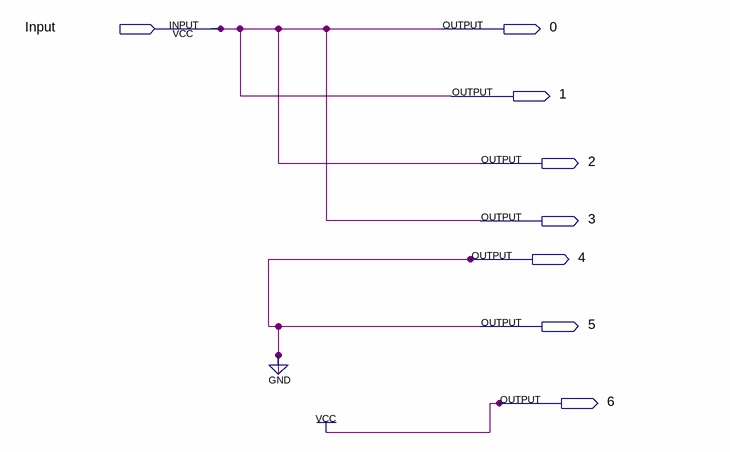
[diagram p0: schematic sheet]
// Quartus schematic CircuitB.bdf as structural Verilog: 0 symbols, 8 pins
module CircuitB (
  input  Input,
  output \0 ,
  output \1 ,
  output \2 ,
  output \3 ,
  output \4 ,
  output \5 ,
  output \6 
);


  assign \0  = Input;
  assign \1  = Input;
  assign \2  = Input;
  assign \3  = Input;
  assign \4  = 1'b0;
  assign \5  = 1'b0;
  assign \6  = 1'b1;
endmodule
